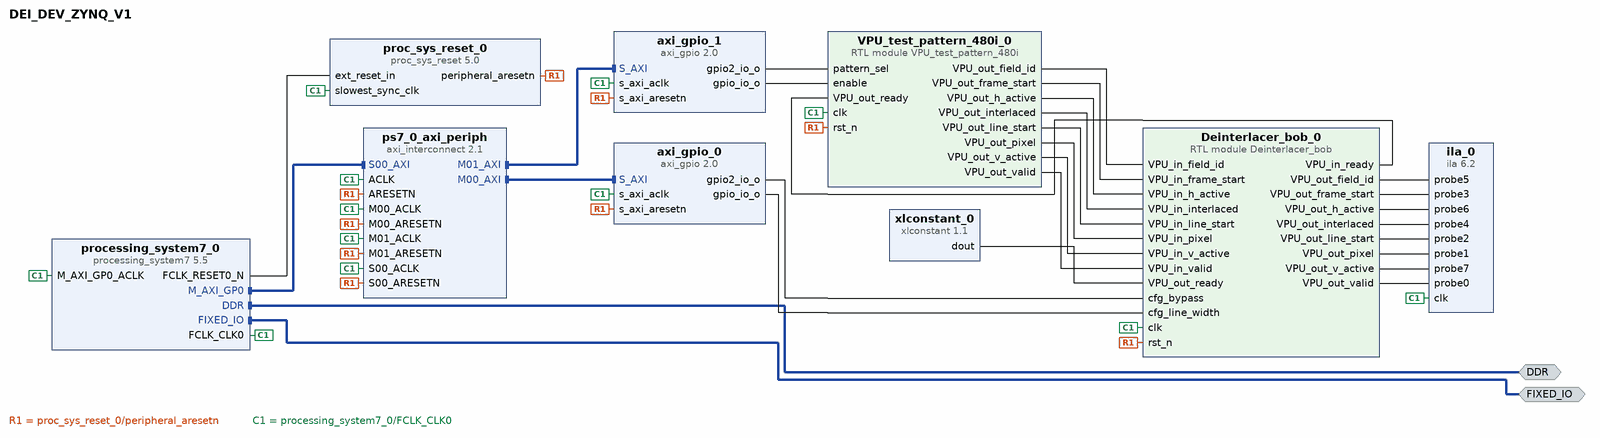
[diagram p0: block diagram of the top level]
# Vivado block design DEI_DEV_ZYNQ_V1, xc7z010clg400-3, Vivado 2025.2
create_bd_design DEI_DEV_ZYNQ_V1

create_bd_intf_port -mode Master -vlnv xilinx.com:interface:ddrx_rtl:1.0 DDR
create_bd_intf_port -mode Master -vlnv xilinx.com:display_processing_system7:fixedio_rtl:1.0 FIXED_IO

create_bd_cell -type ip -vlnv xilinx.com:ip:processing_system7:5.5 processing_system7_0
# 1 more settings of processing_system7_0 are not shown: defaults, MIO pin electricals, DDR timing, and values the tool derives
create_bd_cell -type ip -vlnv xilinx.com:ip:proc_sys_reset:5.0 proc_sys_reset_0
create_bd_cell -type module -reference Deinterlacer_bob Deinterlacer_bob_0
set_property -dict {CONFIG.PIXEL_WIDTH 12} [get_bd_cells Deinterlacer_bob_0]
create_bd_cell -type module -reference VPU_test_pattern_480i VPU_test_pattern_480i_0
set_property -dict {CONFIG.PIXEL_WIDTH 12} [get_bd_cells VPU_test_pattern_480i_0]
create_bd_cell -type ip -vlnv xilinx.com:ip:ila:6.2 ila_0
set_property -dict [list \
  CONFIG.C_DATA_DEPTH 8192 \
  CONFIG.C_MONITOR_TYPE Native \
  CONFIG.C_NUM_OF_PROBES 8 \
  CONFIG.C_PROBE1_WIDTH 12 \
  CONFIG.C_PROBE2_WIDTH 1 \
  CONFIG.C_PROBE6_WIDTH 12 \
  CONFIG.C_PROBE7_WIDTH 12 \
  CONFIG.C_PROBE8_WIDTH 1 \
] [get_bd_cells ila_0]
create_bd_cell -type ip -vlnv xilinx.com:ip:axi_gpio:2.0 axi_gpio_0
set_property -dict [list \
  CONFIG.C_ALL_INPUTS 0 \
  CONFIG.C_ALL_OUTPUTS 1 \
  CONFIG.C_ALL_OUTPUTS_2 1 \
  CONFIG.C_GPIO2_WIDTH 1 \
  CONFIG.C_GPIO_WIDTH 12 \
  CONFIG.C_IS_DUAL 1 \
] [get_bd_cells axi_gpio_0]
create_bd_cell -type ip -vlnv xilinx.com:ip:axi_interconnect:2.1 ps7_0_axi_periph
set_property -dict {CONFIG.NUM_MI 2} [get_bd_cells ps7_0_axi_periph]
create_bd_cell -type ip -vlnv xilinx.com:ip:axi_gpio:2.0 axi_gpio_1
set_property -dict [list \
  CONFIG.C_ALL_INPUTS 0 \
  CONFIG.C_ALL_OUTPUTS 1 \
  CONFIG.C_ALL_OUTPUTS_2 1 \
  CONFIG.C_GPIO2_WIDTH 2 \
  CONFIG.C_GPIO_WIDTH 1 \
  CONFIG.C_IS_DUAL 1 \
] [get_bd_cells axi_gpio_1]
create_bd_cell -type ip -vlnv xilinx.com:ip:xlconstant:1.1 xlconstant_0

# ---- connections ----

connect_bd_intf_net [get_bd_intf_ports DDR] [get_bd_intf_pins processing_system7_0/DDR]
connect_bd_intf_net [get_bd_intf_ports FIXED_IO] [get_bd_intf_pins processing_system7_0/FIXED_IO]
connect_bd_intf_net [get_bd_intf_pins processing_system7_0/M_AXI_GP0] [get_bd_intf_pins ps7_0_axi_periph/S00_AXI]
connect_bd_intf_net [get_bd_intf_pins ps7_0_axi_periph/M00_AXI] [get_bd_intf_pins axi_gpio_0/S_AXI]
connect_bd_intf_net [get_bd_intf_pins ps7_0_axi_periph/M01_AXI] [get_bd_intf_pins axi_gpio_1/S_AXI]
connect_bd_net [get_bd_pins Deinterlacer_bob_0/VPU_in_ready] [get_bd_pins VPU_test_pattern_480i_0/VPU_out_ready]
connect_bd_net [get_bd_pins Deinterlacer_bob_0/VPU_out_field_id] [get_bd_pins ila_0/probe5]
connect_bd_net [get_bd_pins Deinterlacer_bob_0/VPU_out_frame_start] [get_bd_pins ila_0/probe3]
connect_bd_net [get_bd_pins Deinterlacer_bob_0/VPU_out_h_active] [get_bd_pins ila_0/probe6]
connect_bd_net [get_bd_pins Deinterlacer_bob_0/VPU_out_interlaced] [get_bd_pins ila_0/probe4]
connect_bd_net [get_bd_pins Deinterlacer_bob_0/VPU_out_line_start] [get_bd_pins ila_0/probe2]
connect_bd_net [get_bd_pins Deinterlacer_bob_0/VPU_out_pixel] [get_bd_pins ila_0/probe1]
connect_bd_net [get_bd_pins Deinterlacer_bob_0/VPU_out_v_active] [get_bd_pins ila_0/probe7]
connect_bd_net [get_bd_pins Deinterlacer_bob_0/VPU_out_valid] [get_bd_pins ila_0/probe0]
connect_bd_net [get_bd_pins VPU_test_pattern_480i_0/VPU_out_field_id] [get_bd_pins Deinterlacer_bob_0/VPU_in_field_id]
connect_bd_net [get_bd_pins VPU_test_pattern_480i_0/VPU_out_frame_start] [get_bd_pins Deinterlacer_bob_0/VPU_in_frame_start]
connect_bd_net [get_bd_pins VPU_test_pattern_480i_0/VPU_out_h_active] [get_bd_pins Deinterlacer_bob_0/VPU_in_h_active]
connect_bd_net [get_bd_pins VPU_test_pattern_480i_0/VPU_out_interlaced] [get_bd_pins Deinterlacer_bob_0/VPU_in_interlaced]
connect_bd_net [get_bd_pins VPU_test_pattern_480i_0/VPU_out_line_start] [get_bd_pins Deinterlacer_bob_0/VPU_in_line_start]
connect_bd_net [get_bd_pins VPU_test_pattern_480i_0/VPU_out_pixel] [get_bd_pins Deinterlacer_bob_0/VPU_in_pixel]
connect_bd_net [get_bd_pins VPU_test_pattern_480i_0/VPU_out_v_active] [get_bd_pins Deinterlacer_bob_0/VPU_in_v_active]
connect_bd_net [get_bd_pins VPU_test_pattern_480i_0/VPU_out_valid] [get_bd_pins Deinterlacer_bob_0/VPU_in_valid]
connect_bd_net [get_bd_pins axi_gpio_0/gpio2_io_o] [get_bd_pins Deinterlacer_bob_0/cfg_bypass]
connect_bd_net [get_bd_pins axi_gpio_0/gpio_io_o] [get_bd_pins Deinterlacer_bob_0/cfg_line_width]
connect_bd_net [get_bd_pins axi_gpio_1/gpio2_io_o] [get_bd_pins VPU_test_pattern_480i_0/pattern_sel]
connect_bd_net [get_bd_pins axi_gpio_1/gpio_io_o] [get_bd_pins VPU_test_pattern_480i_0/enable]
connect_bd_net [get_bd_pins proc_sys_reset_0/peripheral_aresetn] \
  [get_bd_pins VPU_test_pattern_480i_0/rst_n] [get_bd_pins Deinterlacer_bob_0/rst_n] [get_bd_pins axi_gpio_0/s_axi_aresetn] \
  [get_bd_pins axi_gpio_1/s_axi_aresetn] [get_bd_pins ps7_0_axi_periph/ARESETN] [get_bd_pins ps7_0_axi_periph/S00_ARESETN] \
  [get_bd_pins ps7_0_axi_periph/M00_ARESETN] [get_bd_pins ps7_0_axi_periph/M01_ARESETN]
connect_bd_net [get_bd_pins processing_system7_0/FCLK_CLK0] \
  [get_bd_pins VPU_test_pattern_480i_0/clk] [get_bd_pins Deinterlacer_bob_0/clk] [get_bd_pins axi_gpio_0/s_axi_aclk] \
  [get_bd_pins axi_gpio_1/s_axi_aclk] [get_bd_pins ila_0/clk] [get_bd_pins proc_sys_reset_0/slowest_sync_clk] \
  [get_bd_pins processing_system7_0/M_AXI_GP0_ACLK] [get_bd_pins ps7_0_axi_periph/ACLK] \
  [get_bd_pins ps7_0_axi_periph/S00_ACLK] [get_bd_pins ps7_0_axi_periph/M00_ACLK] [get_bd_pins ps7_0_axi_periph/M01_ACLK]
connect_bd_net [get_bd_pins processing_system7_0/FCLK_RESET0_N] [get_bd_pins proc_sys_reset_0/ext_reset_in]
connect_bd_net [get_bd_pins xlconstant_0/dout] [get_bd_pins Deinterlacer_bob_0/VPU_out_ready]

# ---- address map ----
assign_bd_address -offset 0x41200000 -range 64K -target_address_space [get_bd_addr_spaces processing_system7_0/Data] [get_bd_addr_segs axi_gpio_0/S_AXI/Reg]
assign_bd_address -offset 0x41210000 -range 64K -target_address_space [get_bd_addr_spaces processing_system7_0/Data] [get_bd_addr_segs axi_gpio_1/S_AXI/Reg]

validate_bd_design
save_bd_design
